# EasyEDA Pro project 信号及低压供电板.eprj

# Schematic Schematic1
Board Name: Board1; Create Date: 2025-05-30; Page Name: P1; Project Name: 信号及低压供电板; Schematic Name: Schematic1; Update Date: 2025-07-06; Company: 嘉立创EDA; Page Size: A4; Version: V1.0
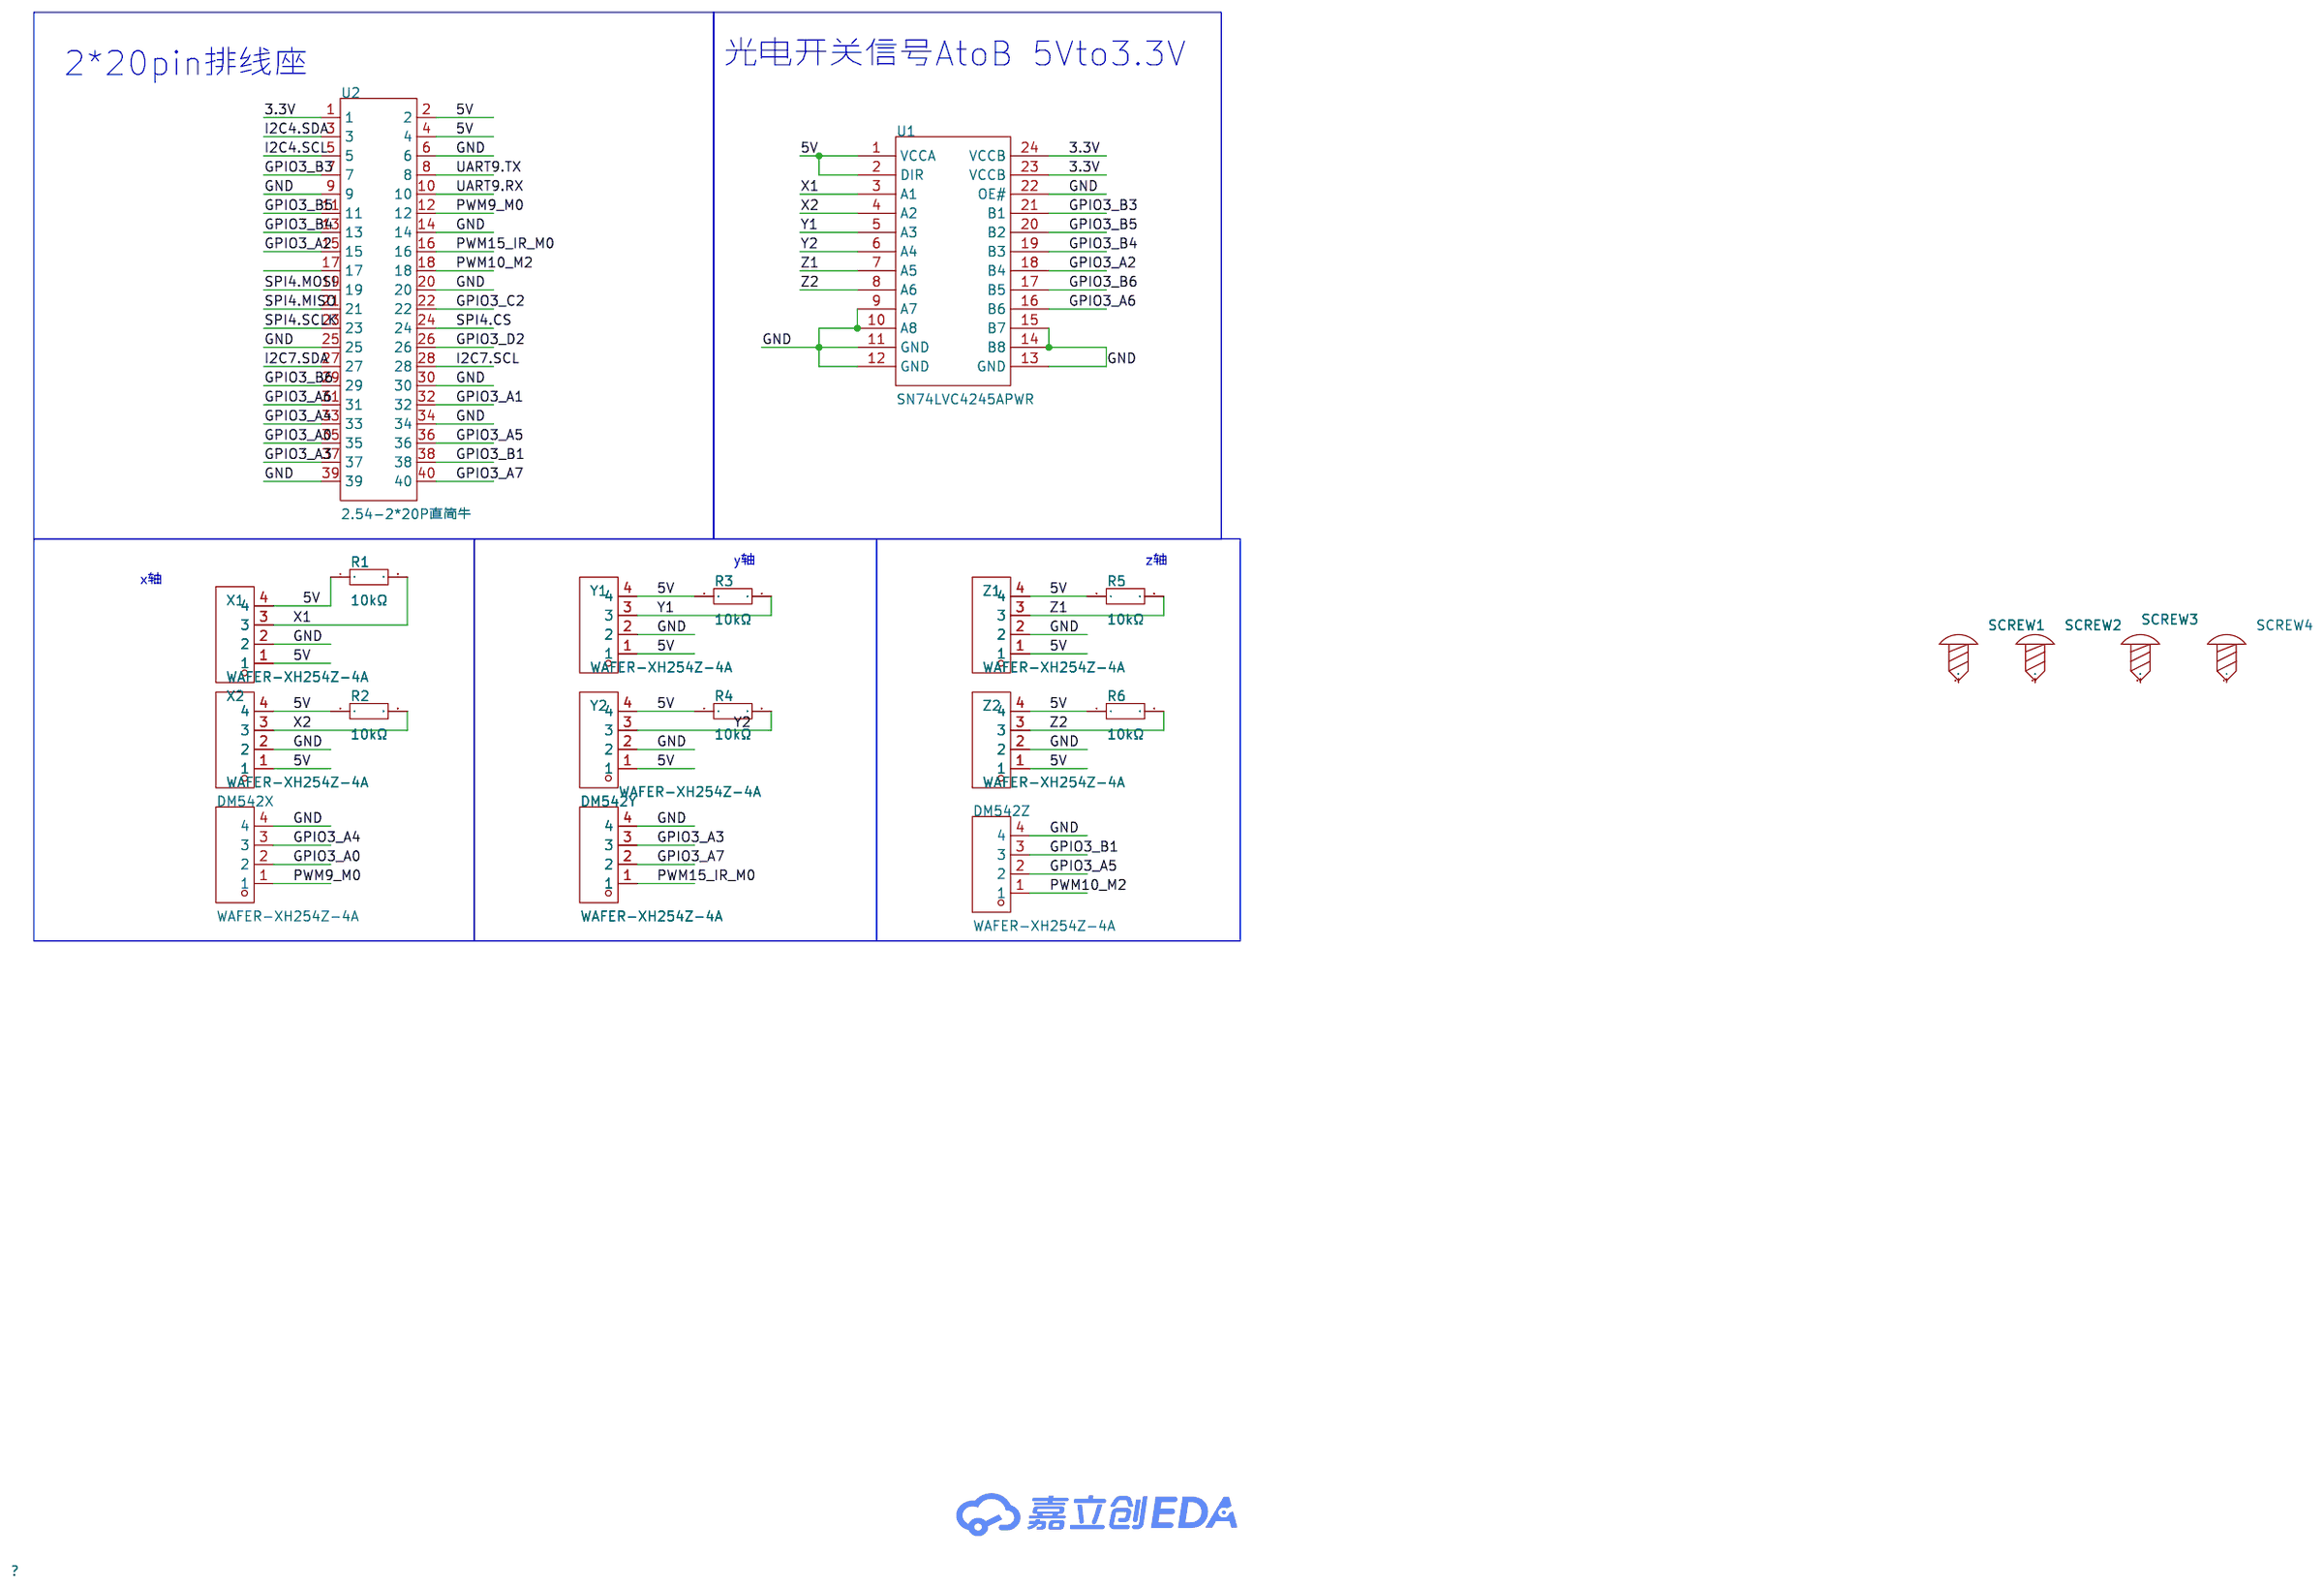
[diagram p0: schematic sheet]

## Parts
DM542X  WAFER-XH254Z-4A  [CONN-TH_XH-4A]
DM542Y  WAFER-XH254Z-4A  [CONN-TH_XH-4A]
DM542Z  WAFER-XH254Z-4A  [CONN-TH_XH-4A]
R1  10kΩ  [R0603]
R2  10kΩ  [R0603]
R3  10kΩ  [R0603]
R4  10kΩ  [R0603]
R5  10kΩ  [R0603]
R6  10kΩ  [R0603]
SCREW1  -  [M3螺丝]
SCREW2  -  [M3螺丝]
SCREW3  -  [M3螺丝]
SCREW4  -  [M3螺丝]
U1  SN74LVC4245APWR  [TSSOP-24_L7.8-W4.4-P0.65-LS6.4-BL]
U2  2.54-2*20P直简牛  [IDC-TH_40P-P2.54_C9138]
X1  WAFER-XH254Z-4A  [CONN-TH_XH-4A]
X2  WAFER-XH254Z-4A  [CONN-TH_XH-4A]
Y1  WAFER-XH254Z-4A  [CONN-TH_XH-4A]
Y2  WAFER-XH254Z-4A  [CONN-TH_XH-4A]
Z1  WAFER-XH254Z-4A  [CONN-TH_XH-4A]
Z2  WAFER-XH254Z-4A  [CONN-TH_XH-4A]

## Library data of the parts
DM542X DM542Y DM542Z = WAFER-XH254Z-4A: LCSC Part Name: 1x4P 间距:2.54mm 直插 系列:XH; Supplier Part: C7432684; Manufacturer: HANBO(汉博); Supplier Footprint: 插件,P=2.5mm; JLCPCB Part Class: 扩展库; Datasheet: https://atta.szlcsc.com/upload/public/pdf/source/20230718/3B4FABA5D38EFB02DAF74E7C2B33D98F.pdf; Supplier: LCSC; Pins Structure: 1x4P; Pitch: 2.54mm; Mounting Type: 直插; Reference Series: XH; Number of Pins: 4P; Number of Rows: 1; Number of PINs Per Row: 4; Current Rating: 3A; Contact Material: 黄铜; Operating Temperature: -25℃~+85℃; Voltage Rating: 250V; Plastic Material: PA66; Flame Retardant Rating: UL94V-0
R1-R6 = 0603WAF1002T5E: LCSC Part Name: 厚膜电阻 10kΩ ±1% 100mW; Supplier Part: C25804; Manufacturer: UNI-ROYAL(厚声); Supplier Footprint: 0603; JLCPCB Part Class: 基础库; Datasheet: https://atta.szlcsc.com/upload/public/pdf/source/20200306/C422600_1E6D84923E4A46A82E41ADD87F860B5C.pdf; Supplier: LCSC; Type: 厚膜电阻; Tolerance: ±1%; Power(Watts): 100mW; Voltage-Supply(Max): 75V; Temperature Coefficient: ±100ppm/℃; Operating Temperature: -55℃~+155℃
SCREW1-SCREW4 = M3螺丝: Supplier Footprint: 插件
U1 = SN74LVC4245APWR: Supplier Part: C7859; Manufacturer: TI(德州仪器); Supplier Footprint: TSSOP-24; JLCPCB Part Class: 扩展库; Datasheet: https://www.ti.com/cn/lit/gpn/sn74lvc4245a; Supplier: LCSC; Channel Type: 双向; Voltage - Supply(VCCA): 4.5V~5.5V; Voltage - Supply(VCCB): 2.7V~3.6V; Number of Circuits: 8; Output Type: 三态; Operating Temperature: -40℃~+85℃
U2 = 2.54-2*20P直简牛: LCSC Part Name: 2.54mm 2x20P 排数:2 每排P数:20; Supplier Part: C9138; Manufacturer: BOOMELE(博穆精密); Supplier Footprint: 插件,P=2.54mm; JLCPCB Part Class: Extended Part; Datasheet: https://atta.szlcsc.com/upload/public/pdf/source/20131122/1457706661483.pdf; Supplier: LCSC; Connector Type: 简牛座; Pitch: 2.54mm; Structure: 2x20P; Holder Type: 直插; Row Spacing: 2.54mm; Number of Rows: 2; Pin Number in each Row: 20
X1 X2 Y1 Y2 Z1 Z2 = WAFER-XH254Z-4A: LCSC Part Name: 1x4P 间距:2.54mm 直插 系列:XH; Supplier Part: C7432684; Manufacturer: HANBO(汉博); Supplier Footprint: 插件,P=2.5mm; JLCPCB Part Class: Extended Part; Datasheet: https://atta.szlcsc.com/upload/public/pdf/source/20230718/3B4FABA5D38EFB02DAF74E7C2B33D98F.pdf; Supplier: LCSC; Pins Structure: 1x4P; Pitch: 2.54mm; Mounting Type: 直插; Reference Series: XH; Number of Pins: 4P; Number of Rows: 1; Number of PINs Per Row: 4; Current Rating: 3A; Contact Material: 黄铜; Operating Temperature: -25℃~+85℃; Voltage Rating: 250V; Plastic Material: PA66; Flame Retardant Rating: UL94V-0

## Nets
3.3V: U1.23(VCCB) U1.24(VCCB) U2.1
5V: R1.1 R2.1 R3.1 R4.1 R5.1 R6.1 U1.1(VCCA) U1.2(DIR) U2.2 U2.4 X1.1 X1.4 X2.1 X2.4 Y1.1 Y1.4 Y2.1 Y2.4 Z1.1 Z1.4 Z2.1 Z2.4
GND: DM542X.4 DM542Y.4 DM542Z.4 U1.9(A7) U1.10(A8) U1.11(GND) U1.12(GND) U1.13(GND) U1.14(B8) U1.15(B7) U1.22(OE#) U2.6 U2.9 U2.14 U2.20 U2.25 U2.30 U2.34 U2.39 X1.2 X2.2 Y1.2 Y2.2 Z1.2 Z2.2
GPIO3_A0: DM542X.2 U2.35
GPIO3_A1: U2.32
GPIO3_A2: U1.18(B4) U2.15
GPIO3_A3: DM542Y.3 U2.37
GPIO3_A4: DM542X.3 U2.33
GPIO3_A5: DM542Z.2 U2.36
GPIO3_A6: U1.16(B6) U2.31
GPIO3_A7: DM542Y.2 U2.40
GPIO3_B1: DM542Z.3 U2.38
GPIO3_B3: U1.21(B1) U2.7
GPIO3_B4: U1.19(B3) U2.13
GPIO3_B5: U1.20(B2) U2.11
GPIO3_B6: U1.17(B5) U2.29
GPIO3_C2: U2.22
GPIO3_D2: U2.26
I2C4.SCL: U2.5
I2C4.SDA: U2.3
I2C7.SCL: U2.28
I2C7.SDA: U2.27
PWM9_M0: DM542X.1 U2.12
PWM10_M2: DM542Z.1 U2.18
PWM15_IR_M0: DM542Y.1 U2.16
SPI4.CS: U2.24
SPI4.MISO: U2.21
SPI4.MOSI: U2.19
SPI4.SCLK: U2.23
UART9.RX: U2.10
UART9.TX: U2.8
X1: R1.2 U1.3(A1) X1.3
X2: R2.2 U1.4(A2) X2.3
Y1: R3.2 U1.5(A3) Y1.3
Y2: R4.2 U1.6(A4) Y2.3
Z1: R5.2 U1.7(A5) Z1.3
Z2: R6.2 U1.8(A6) Z2.3

Not connected (* = marked no-connect by the designer): SCREW1 1; SCREW2 1; SCREW3 1; SCREW4 1; U2 17

## Notes on the sheet
- 2*20pin排线座
- 光电开关信号AtoB 5Vto3.3V
- x轴
- y轴
- z轴

# Board PCB1
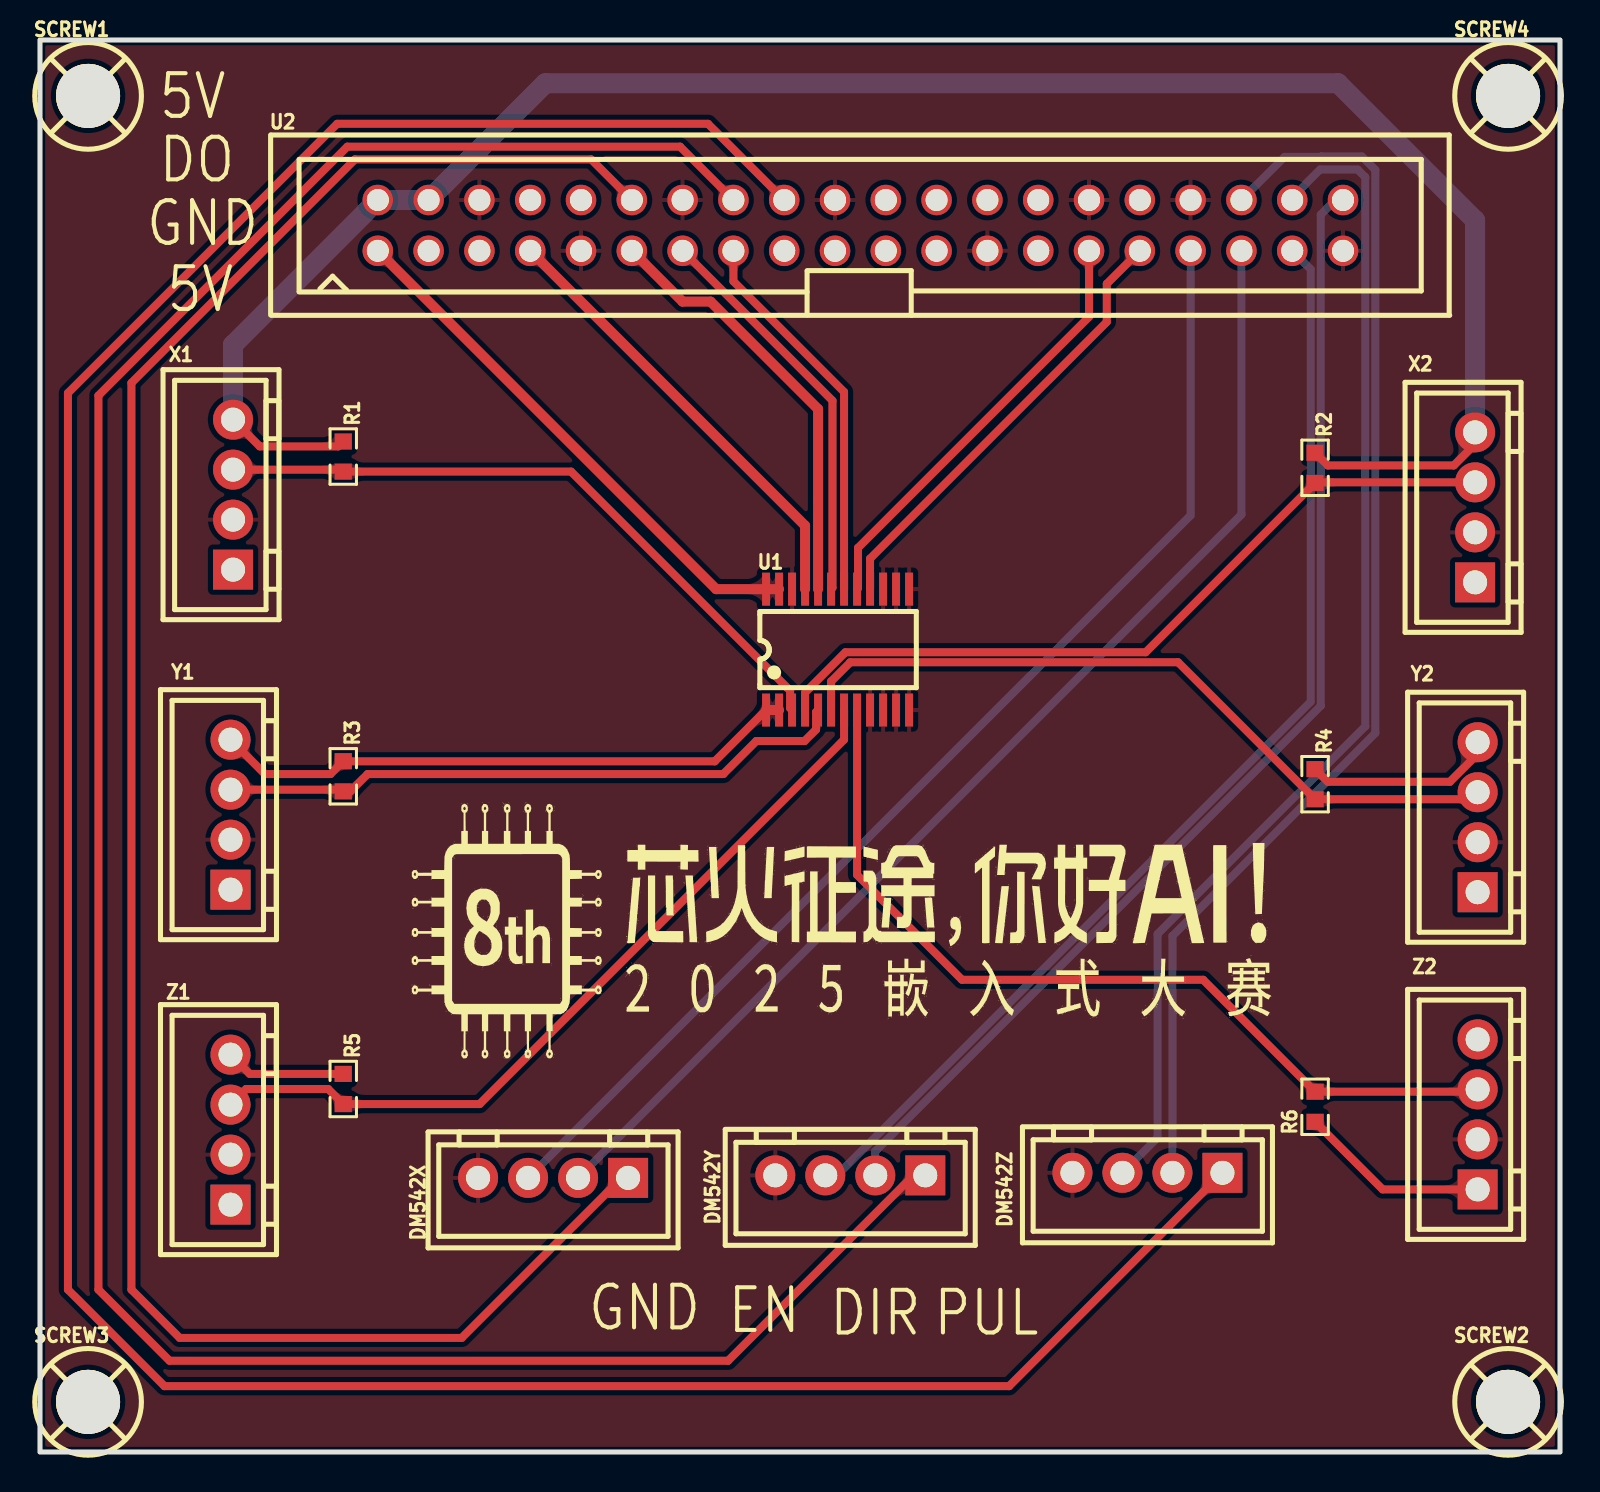
[diagram p1: board, top side]
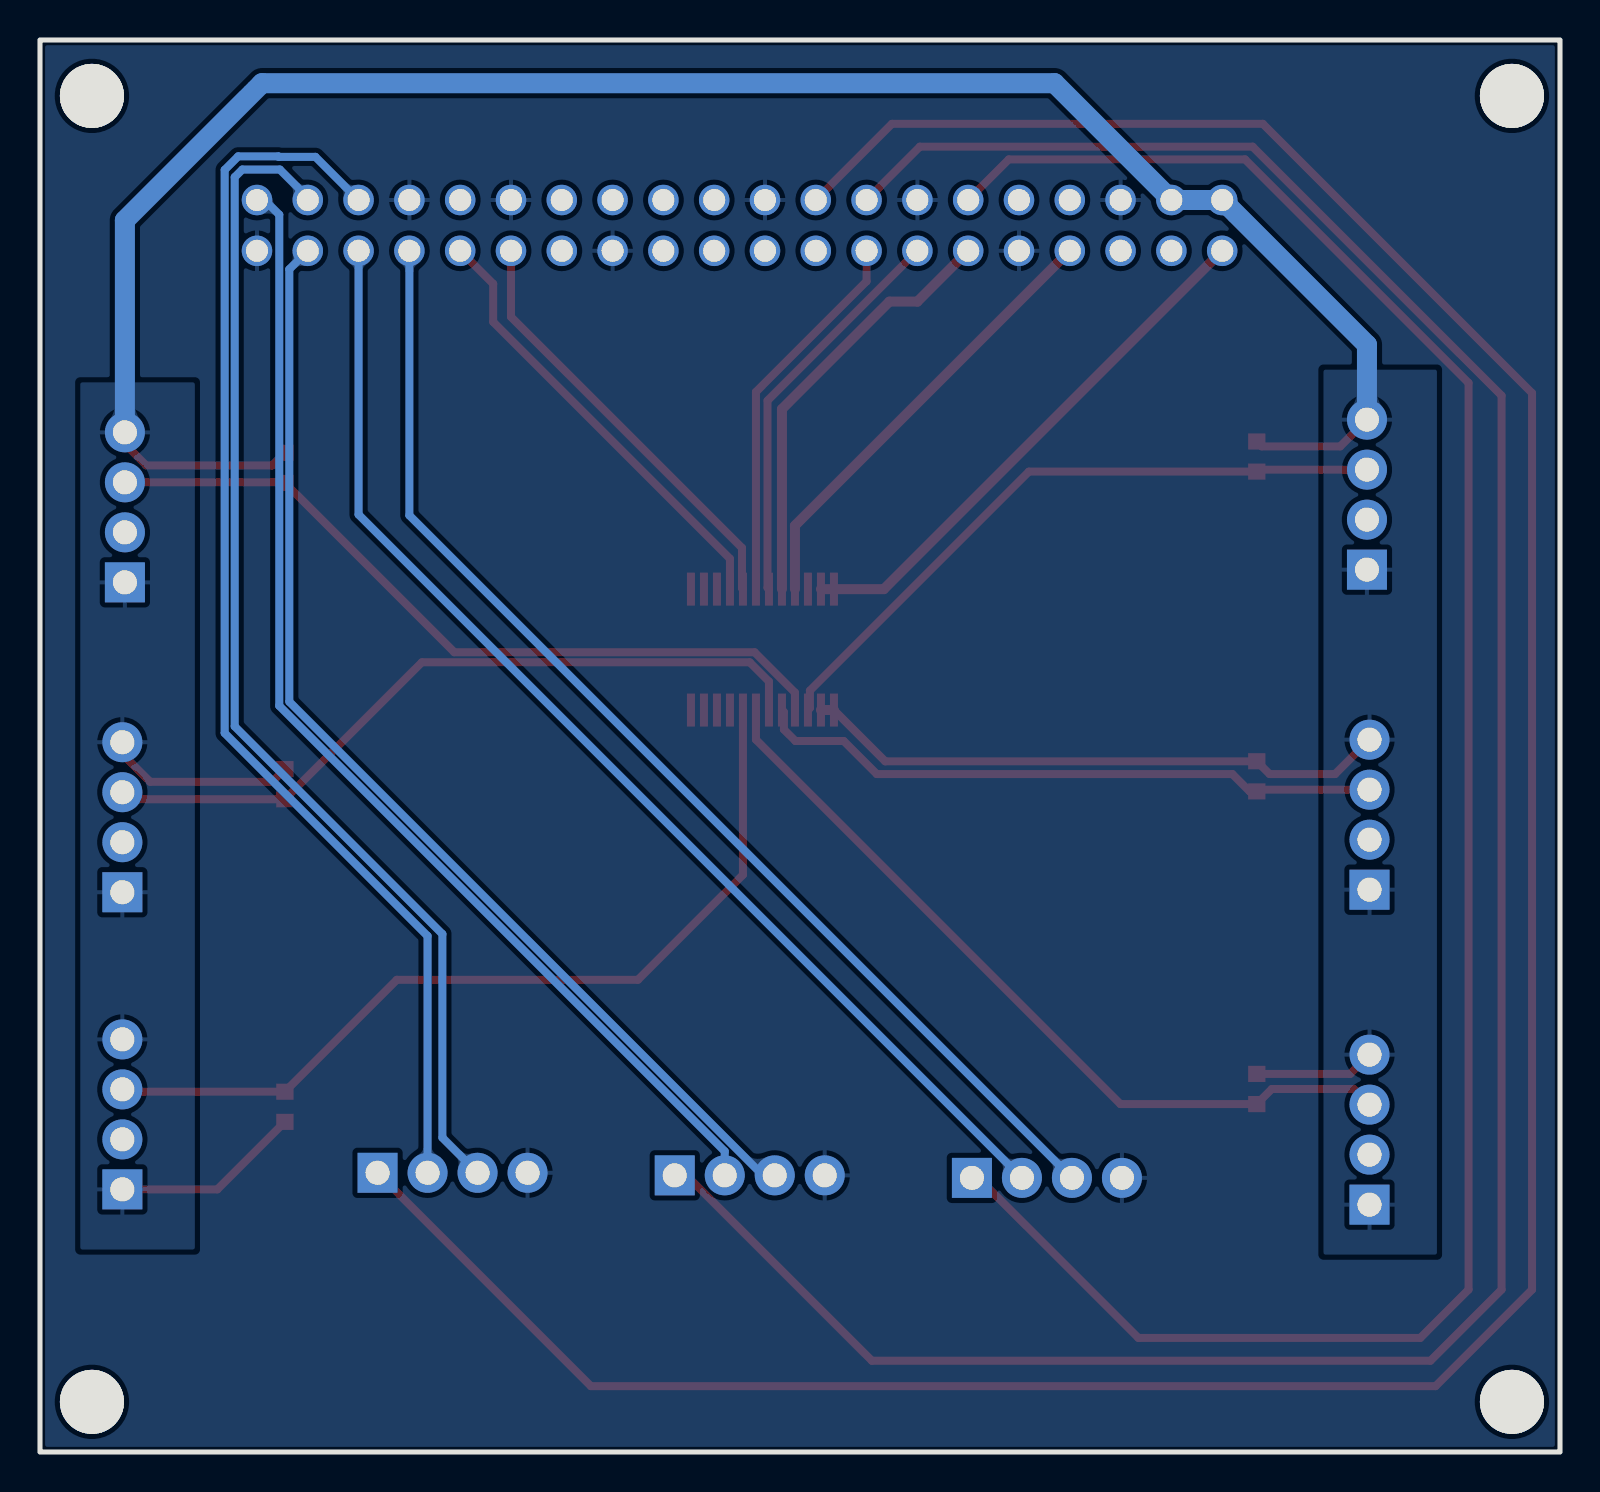
[diagram p2: board, bottom side, seen from below]

Outline 76 x 70.6 mm; copper layers: Top Layer, Bottom Layer. Coordinates in mm from the lower left corner of the outline.
Outline path: rectangle 0,70.6 76,0
Stack: Top Layer 0.035mm / Dielectric1 1.51mm FR4 er 4.5 / Bottom Layer 0.035mm

## Design rules (mm)
template: JLCPCB Capability(Two Layers Board)
spacing copperThickness1oz (default): track to track 0.102, other pairs 0.152 to 0.3
spacing copperThickness2oz: track to track 0.203, other pairs 0.152 to 0.3
track width copperThickness1oz (default): min 0.127, default 0.254, max 2.54
track width copperThickness2oz: min 0.203, default 0.254, max 2.54
differential pair differentialPair (default): width min 0.127, default 0.254, max 2.54; gap min 0.152, default 0.152
via viaSize (default): diameter min 0.5, default 0.61, max 10; hole min 0.3, default 0.305, max 6.3

## Placement (name value [footprint] x y rotation side)
DM542X  WAFER-XH254Z-4A  [CONN-TH_XH-4A]  25.65 13.71 180 top
DM542Y  WAFER-XH254Z-4A  [CONN-TH_XH-4A]  40.51 13.83 180 top
DM542Z  WAFER-XH254Z-4A  [CONN-TH_XH-4A]  55.37 13.96 180 top
R1  10kΩ  [R0603]  15.16 49.77 270 top
R2  10kΩ  [R0603]  63.75 49.21 270 top
R3  10kΩ  [R0603]  15.16 33.79 270 top
R4  10kΩ  [R0603]  63.75 33.39 270 top
R5  10kΩ  [R0603]  15.16 18.15 270 top
R6  10kΩ  [R0603]  63.75 17.26 90 top
SCREW1  -  [M3螺丝]  2.4 67.81 0 top
SCREW2  -  [M3螺丝]  73.4 2.51 0 top
SCREW3  -  [M3螺丝]  2.4 2.51 0 top
SCREW4  -  [M3螺丝]  73.4 67.81 0 top
U1  SN74LVC4245APWR  [TSSOP-24_L7.8-W4.4-P0.65-LS6.4-BL]  39.88 40.12 0 top
U2  2.54-2*20P直简牛  [IDC-TH_40P-P2.54_C9138]  41.02 61.33 0 top
X1  WAFER-XH254Z-4A  [CONN-TH_XH-4A]  9.65 47.87 90 top
X2  WAFER-XH254Z-4A  [CONN-TH_XH-4A]  71.75 47.23 90 top
Y1  WAFER-XH254Z-4A  [CONN-TH_XH-4A]  9.52 31.87 90 top
Y2  WAFER-XH254Z-4A  [CONN-TH_XH-4A]  71.88 31.74 90 top
Z1  WAFER-XH254Z-4A  [CONN-TH_XH-4A]  9.52 16.12 90 top
Z2  WAFER-XH254Z-4A  [CONN-TH_XH-4A]  71.88 16.88 90 top

## Footprints (pads in the part's own frame, mm; a bottom-side part is the same pattern mirrored in y, then rotated)
CONN-TH_XH-4A
  rect 2x2 hole 1.2: 1(-3.75,0)
  round 2 hole 1.2: 2(-1.25,0) 3(1.25,0) 4(3.75,0)
IDC-TH_40P-P2.54_C9138
  round 1.524 hole 1.1: 1(-24.13,-1.27) 2(-24.13,1.27) 3(-21.59,-1.27) 4(-21.59,1.27) 5(-19.05,-1.27) 6(-19.05,1.27) 7(-16.51,-1.27) 8(-16.51,1.27) 9(-13.97,-1.27) 10(-13.97,1.27) 11(-11.43,-1.27) 12(-11.43,1.27) 13(-8.89,-1.27) 14(-8.89,1.27) 15(-6.35,-1.27) 16(-6.35,1.27) 17(-3.81,-1.27) 18(-3.81,1.27) 19(-1.27,-1.27) 20(-1.27,1.27) 21(1.27,-1.27) 22(1.27,1.27) 23(3.81,-1.27) 24(3.81,1.27) 25(6.35,-1.27) 26(6.35,1.27) 27(8.89,-1.27) 28(8.89,1.27) 29(11.43,-1.27) 30(11.43,1.27) 31(13.97,-1.27) 32(13.97,1.27) 33(16.51,-1.27) 34(16.51,1.27) 35(19.05,-1.27) 36(19.05,1.27) 37(21.59,-1.27) 38(21.59,1.27) 39(24.13,-1.27) 40(24.13,1.27)
M3螺丝
  round 3.2 hole 3.2: 1(0,0)
R0603
  rect 0.806x0.864 smd: 1(-0.753,0) 2(0.753,0)
TSSOP-24_L7.8-W4.4-P0.65-LS6.4-BL
  rect 0.4x1.65 smd: 1(-3.575,-3.022) 2(-2.925,-3.022) 3(-2.275,-3.022) 4(-1.625,-3.022) 5(-0.975,-3.022) 6(-0.325,-3.022) 7(0.325,-3.022) 8(0.975,-3.022) 9(1.625,-3.022) 10(2.275,-3.022) 11(2.925,-3.022) 12(3.575,-3.022) 13(3.575,3.022) 14(2.925,3.022) 15(2.275,3.022) 16(1.625,3.022) 17(0.975,3.022) 18(0.325,3.022) 19(-0.325,3.022) 20(-0.975,3.022) 21(-1.625,3.022) 22(-2.275,3.022) 23(-2.925,3.022) 24(-3.575,3.022)

## Nets
As in the schematic.

Pads without a net: SCREW1 1; SCREW2 1; SCREW3 1; SCREW4 1

## Routing (per net, layer and track width the routed paths; a pad name or vN(x,y) marks a point on that pad's centre or on a via; arc(x,y) is an arc through that point)
3.3V: length 27.1
  Top Layer w0.5: U1.23 U1.24 33.81,43.14 U2.1
5V: length 154.8
  Top Layer w0.4: Z1.4 10.49,18.9 R5.1 ; Z2.1 67.13,13.13 R6.1 ; X2.4 71.75,50.4 70.69,49.33 64.39,49.33 R2.1 ; X1.4 10.99,50.28 14.92,50.28 R1.1 ; Y2.4 71.88,34.9 70.49,33.51 64.39,33.51 R4.1 ; Y1.4 11.24,33.9 14.52,33.9 R3.1 15.17,34.53 33.74,34.53 U1.1
  Top Layer w0.5: U1.1 U1.2
  Bottom Layer w1: X2.4 71.75,61.58 64.9,68.44 25.27,68.44 19.43,62.6 U2.2 9.65,55.36 X1.4
GPIO3_A0: length 60.1
  Bottom Layer w0.4: DM542X.2 60.07,46.87 U2.35
GPIO3_A2: length 19.2
  Top Layer w0.4: 40.2,43.14 40.2,53 34.67,58.54 U2.15
GPIO3_A3: length 57
  Bottom Layer w0.4: U2.37 63.53,59.14 63.53,37.52 39.85,13.83 DM542Y.3
GPIO3_A4: length 60.1
  Bottom Layer w0.4: DM542X.3 57.53,46.83 57.53,60.06
GPIO3_A5: length 62.2
  Bottom Layer w0.4: U2.36 62.23,64.76 64.06,64.76 64.08,64.78 66.09,64.78 66.77,64.11 66.77,35.95 56.62,25.8 DM542Z.2
GPIO3_A6: length 22.5
  Top Layer w0.4: U2.31 53.34,58.41 53.34,56.5 41.5,44.67 U1.16
GPIO3_A7: length 58.7
  Bottom Layer w0.4: DM542Y.2 41.76,15.03 64.04,37.31 64.04,61.87 64.77,62.6 U2.40
GPIO3_B1: length 59.3
  Bottom Layer w0.4: U2.38 62.61,62.73 64.01,64.12 65.88,64.12 66.26,63.74 66.26,36.28 55.88,25.9 55.88,15.72 DM542Z.3
GPIO3_B3: length 22.6
  Top Layer w0.5: U1.21 38.25,46.32 U2.7
GPIO3_B4: length 20
  Top Layer w0.4: U1.19 39.62,43.22 39.62,52.57 32.13,60.06
GPIO3_B5: length 21.6
  Top Layer w0.5: 29.59,60.06 32.13,57.52 33.53,57.52 38.9,52.15 U1.20
GPIO3_B6: length 21.7
  Top Layer w0.4: U2.29 52.45,56.76 40.9,45.21 40.9,43.19 U1.17
PWM9_M0: length 105
  Top Layer w0.4: DM542X.1 29.08,13.71 21.08,5.7 6.98,5.7 4.57,8.12 4.57,53.46 15.75,64.63 27.56,64.63 29.59,62.6
PWM10_M2: length 151.9
  Top Layer w0.4: U2.18 33.4,66.41 14.86,66.41 1.4,52.95 1.4,8.12 6.22,3.29 48.45,3.29 DM542Z.1
PWM15_IR_M0: length 129.4
  Top Layer w0.4: DM542Y.1 43.67,13.83 34.4,4.56 6.48,4.56 2.92,8.12 2.92,52.82 15.37,65.27 32,65.27 U2.16
UART9.RX: length 0.4
  Bottom Layer w0.4: U2.10 26.8,62.85
X1: length 33.4
  Top Layer w0.4: 37.6,37.1 37.5,37.2 37.5,38.07 26.56,49.02 R1.2 15.06,49.12 X1.3
X2: length 38.7
  Top Layer w0.4: X2.3 63.78,48.48 R2.2 55.29,39.99 40.27,39.99 38.25,37.97 U1.4
Y1: length 31.6
  Top Layer w0.4: Y1.3 15.08,33.12 R3.2 15.52,33.03 16.38,33.9 34.16,33.9 35.81,35.55 38.23,35.55 38.81,36.13 38.81,37 U1.5
Y2: length 37.1
  Top Layer w0.4: U1.6 39.55,38.53 40.51,39.49 56.9,39.49 R4.2 71.02,32.64 71.37,32.99 Y2.3
Z1: length 40.3
  Top Layer w0.4: 40.2,37.1 40.2,35.62 21.98,17.4 R5.2 14.41,18.15 10.31,18.15 Z1.3
Z2: length 43.8
  Top Layer w0.4: Z2.3 71.77,18.02 R6.2 58.16,23.61 46.1,23.61 40.85,28.86 U1.8

## Copper pours and planes (outline as drawn; the poured copper is in the pictures)
5V on Bottom Layer: 68.25,53.48 73.98,53.48 73.98,10.12 68.25,10.12
5V on Bottom Layer: 6.15,54.12 11.83,54.12 11.83,9.87 6.15,9.87
GND on Top Layer: 0,70.6 76,70.6 76,0 0,0
GND on Bottom Layer: -0.26,70.6 76,70.6 76,0 -0.26,0

Small or netless copper shapes (teardrops, artwork), in the pictures only: 47 on Top Layer, 17 on Bottom Layer

## Text on the board
Top Silkscreen Layer: GND | 5V | DO | EN | DIR | PUL
